# Altium schematic sheet Drivers_Matrices.SchDoc
size A3; Author: Jérémie Jean-Elie; Organization: ETML-ES; Address1: Avenue Recordon 1; Address2: 1004 Lausanne; Address3: Switzerland; Revision: 1; SheetNumber: 4; SheetTotal: 7; Version: E
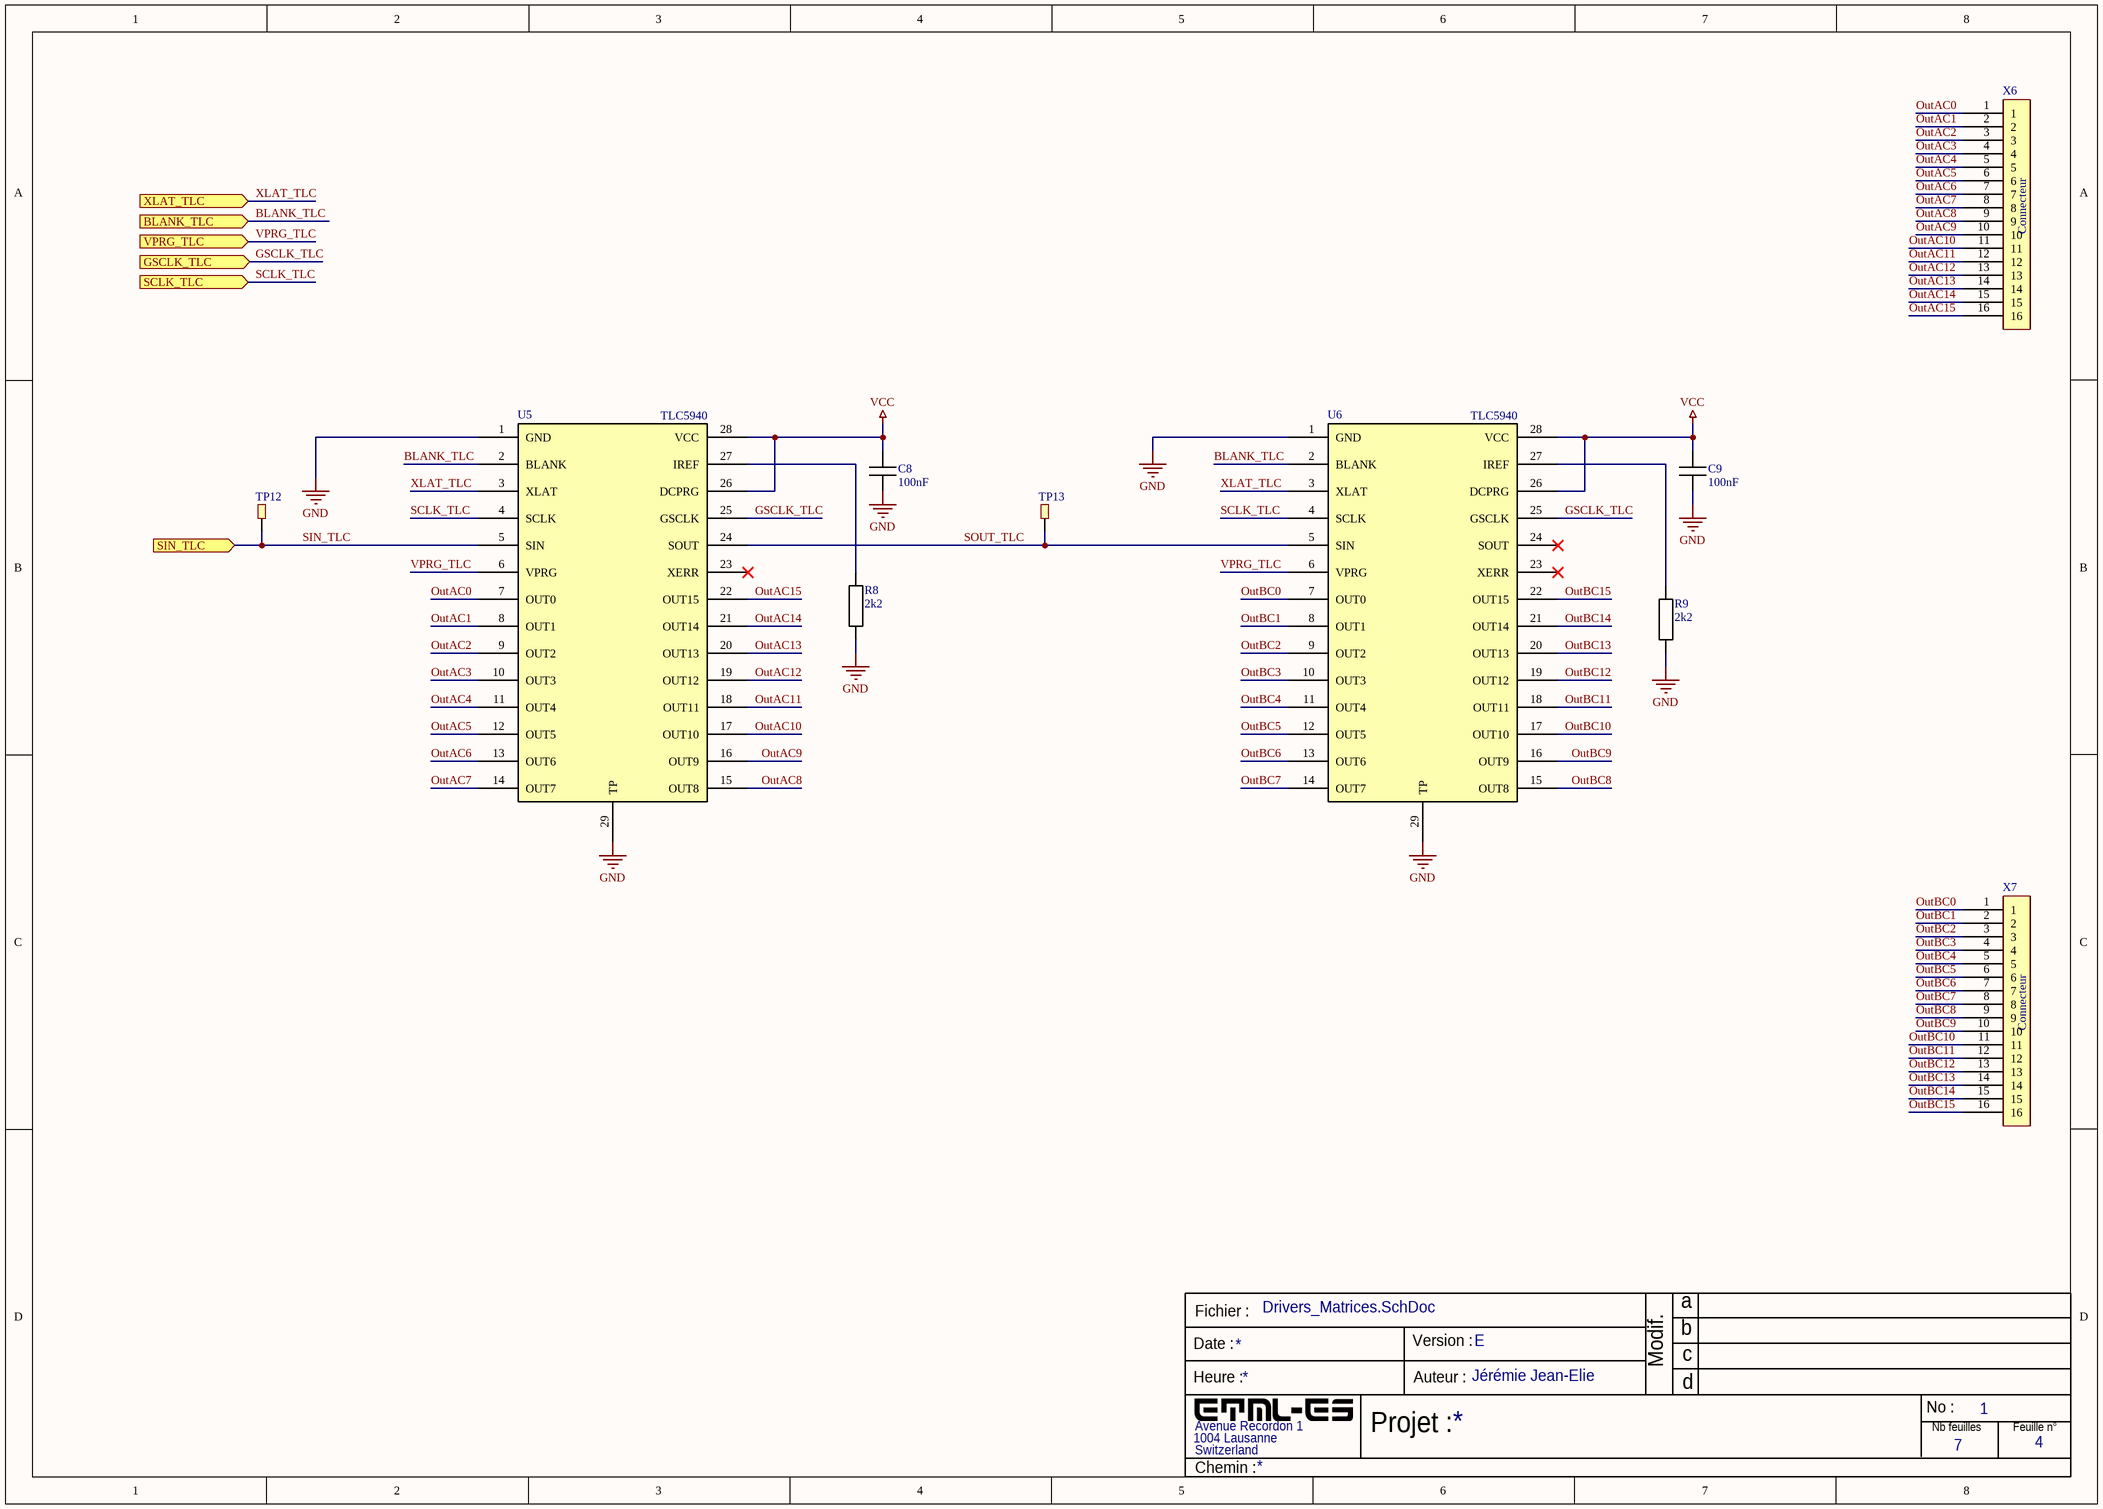
[diagram p0: Drivers_Matrices.SchDoc]

## Parts
C8  100nF  [CAPC1608X08M]
C9  100nF  [CAPC1608X08M]
R8  2k2  [RESC1608X06M]
R9  2k2  [RESC1608X06M]
TP12  TestPoint  [KEYSTONE_5019]  (value not drawn)
TP13  TestPoint  [KEYSTONE_5019]  (value not drawn)
U5  TLC5940  [TSOP65P640X120_HS-29N]
U6  TLC5940  [TSOP65P640X120_HS-29N]
X6  (no value)  [MOLEX_2x8]
X7  (no value)  [MOLEX_2x8]

## Ports
BLANK_TLC (in, see Schema_bloc[2C], Microcontroleur[4B]), GSCLK_TLC (in, see Schema_bloc[2C], Microcontroleur[4B]), SCLK_TLC (in, see Schema_bloc[2C], Microcontroleur[1B]), SIN_TLC (in, see Schema_bloc[2C], Microcontroleur[4B]), VPRG_TLC (in, see Schema_bloc[2C], Microcontroleur[4C]), XLAT_TLC (in, see Schema_bloc[2C], Microcontroleur[4B])

## Nets
GND: C8.1 C9.1 R8.1 R9.1 U5.1(GND) U5.29(TP) U6.1(GND) U6.29(TP)
VCC: C8.2 C9.2 U5.26(DCPRG) U5.28(VCC) U6.26(DCPRG) U6.28(VCC)
BLANK_TLC: U5.2(BLANK) U6.2(BLANK) ; port BLANK_TLC
GSCLK_TLC: U5.25(GSCLK) U6.25(GSCLK) ; port GSCLK_TLC
OutAC0: U5.7(OUT0) X6.1
OutAC1: U5.8(OUT1) X6.2
OutAC2: U5.9(OUT2) X6.3
OutAC3: U5.10(OUT3) X6.4
OutAC4: U5.11(OUT4) X6.5
OutAC5: U5.12(OUT5) X6.6
OutAC6: U5.13(OUT6) X6.7
OutAC7: U5.14(OUT7) X6.8
OutAC8: U5.15(OUT8) X6.9
OutAC9: U5.16(OUT9) X6.10
OutAC10: U5.17(OUT10) X6.11
OutAC11: U5.18(OUT11) X6.12
OutAC12: U5.19(OUT12) X6.13
OutAC13: U5.20(OUT13) X6.14
OutAC14: U5.21(OUT14) X6.15
OutAC15: U5.22(OUT15) X6.16
OutBC0: U6.7(OUT0) X7.1
OutBC1: U6.8(OUT1) X7.2
OutBC2: U6.9(OUT2) X7.3
OutBC3: U6.10(OUT3) X7.4
OutBC4: U6.11(OUT4) X7.5
OutBC5: U6.12(OUT5) X7.6
OutBC6: U6.13(OUT6) X7.7
OutBC7: U6.14(OUT7) X7.8
OutBC8: U6.15(OUT8) X7.9
OutBC9: U6.16(OUT9) X7.10
OutBC10: U6.17(OUT10) X7.11
OutBC11: U6.18(OUT11) X7.12
OutBC12: U6.19(OUT12) X7.13
OutBC13: U6.20(OUT13) X7.14
OutBC14: U6.21(OUT14) X7.15
OutBC15: U6.22(OUT15) X7.16
SCLK_TLC: U5.4(SCLK) U6.4(SCLK) ; port SCLK_TLC
SIN_TLC: TP12.1 U5.5(SIN) ; port SIN_TLC
SOUT_TLC: TP13.1 U5.24(SOUT) U6.5(SIN)
VPRG_TLC: U5.6(VPRG) U6.6(VPRG) ; port VPRG_TLC
XLAT_TLC: U5.3(XLAT) U6.3(XLAT) ; port XLAT_TLC
NetR8_2: R8.2 U5.27(IREF)
NetR9_2: R9.2 U6.27(IREF)

Not connected (* = marked no-connect by the designer): U5 23(XERR)*; U6 23(XERR)* 24(SOUT)*

## Notes on the sheet
- Fichier :
- a
- Date :
- Heure :
- Version :
- Auteur :
- Modif.
- b
- c
- d
- Projet :
- No :
- Nb feuilles
- Feuille n°
- Chemin :
- (in symbol Mâle DIN 8 x 8) Connecteur

## Library data of the parts
C8 C9 = CMP-065-000000-2: CAPC 100nF X7R 50V 10% 1608 (0603 INCH); Manufacturer: TDK; Manufacturer Number: CGA3E2X7R1H104K080AA; IsStocked: 1; PN: PN-338083; Current: NULL; TemperatureRange: -55°C to +125°C; Voltage: 50V; Dielectric: X7R; Value: 100nF; Category: Passives; Supplier Price 1: 0.0100; Supplier Part Number 1: FAB.0603_C 100n; SubCategory: Condensateurs ceramique; Tolerance: ±10%; Supplier 1: ETML; TemperatureCoeff: NULL; Power: NULL
R8 R9 = CMP-066-000116-2: RES 2.2kohm  ±1% 0.1W  1608 (0603 INCH); Manufacturer Number: RC0603FR-072K2L; Manufacturer: Yageo; TemperatureCoeff: ±100ppm/°C; TemperatureRange: -55°C to 155°C; IsStocked: 1; Voltage: 75V; PN: PN-844453; Value: 2.2k; Power: 0.1W; Category: Passives; Supplier Part Number 1: FAB.0603_R 2k2; Supplier 1: ETML; SubCategory: Resistances couche epaisse; Supplier Price 1: 0.0200; Tolerance: ±1%
X6 X7 = Mâle DIN 8 x 8